# EAGLE design Un_Moto (EAGLE 6.2)
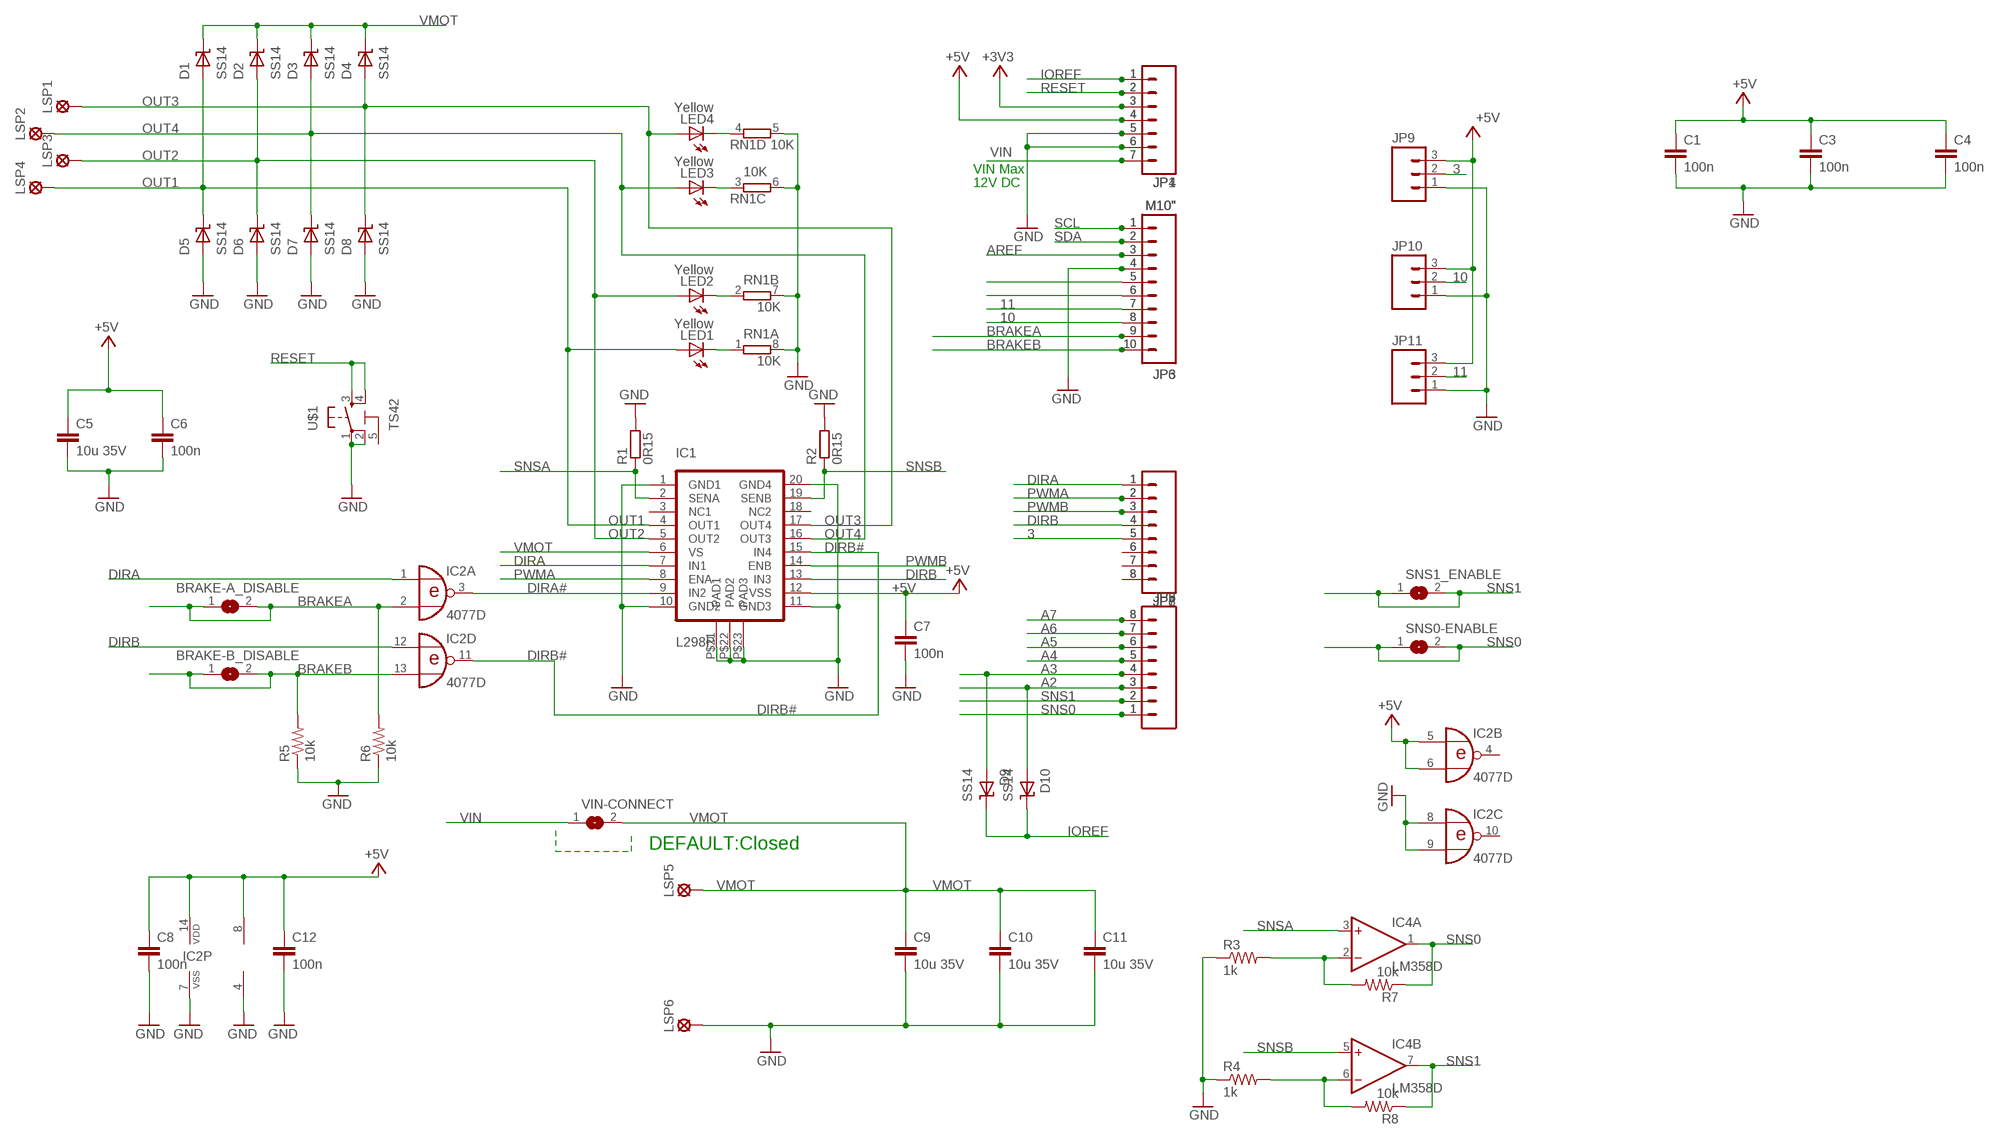
[diagram p0: schematic, sheet 1]

## Parts
BRAKE-A_DISABLE  SJ  [SJ]
BRAKE-B_DISABLE  SJ  [SJ]
C1  100n  C-EUC0603  [C0603-ROUND]
C3  100n  C-EUC0603  [C0603-ROUND]
C4  100n  C-EUC0603  [C0603-ROUND]
C5  10u 35V  C-EUC1210  [C1210]
C6  100n  C-EUC0603  [C0603-ROUND]
C7  100n  C-EUC0603  [C0603-ROUND]
C8  100n  C-EUC0603  [C0603-ROUND]
C9  10u 35V  C-EUC1210  [C1210]
C10  10u 35V  C-EUC1210  [C1210]
C11  10u 35V  C-EUC1210  [C1210]
C12  100n  C-EUC0603  [C0603-ROUND]
D1  SS14  [SMA]
D2  SS14  [SMA]
D3  SS14  [SMA]
D4  SS14  [SMA]
D5  SS14  [SMA]
D6  SS14  [SMA]
D7  SS14  [SMA]
D8  SS14  [SMA]
D9  SS14  [SMA]
D10  SS14  [SMA]
IC1  L298P  [POWER-SO20]
IC2  4077D  [SO14]
IC4  LM358D  [SO08]
JP1  M07  [1X07]
JP2  M081X08  [1X08]
JP3  M10"  [1X10]
JP4  M07  [1X07]
JP5  M081X08  [1X08]
JP6  M10"  [1X10]
JP7  M081X08  [1X08]
JP8  M081X08  [1X08]
JP9  M03PTH  [1X03]
JP10  M03PTH  [1X03]
JP11  M03PTH  [1X03]
LED1  Yellow  LEDCHIPLED_0805  [CHIPLED_0805]
LED2  Yellow  LEDCHIPLED_0805  [CHIPLED_0805]
LED3  Yellow  LEDCHIPLED_0805  [CHIPLED_0805]
LED4  Yellow  LEDCHIPLED_0805  [CHIPLED_0805]
LSP1  LSP13  [LSP13]
LSP2  LSP13  [LSP13]
LSP3  LSP13  [LSP13]
LSP4  LSP13  [LSP13]
LSP5  LSP13  [LSP13]
LSP6  LSP13  [LSP13]
R1  0R15  R-EU_R1206  [R1206]
R2  0R15  R-EU_R1206  [R1206]
R3  1k  RESISTOR0805-RES  [0805]
R4  1k  RESISTOR0805-RES  [0805]
R5  10k  RESISTOR0805-RES  [0805]
R6  10k  RESISTOR0805-RES  [0805]
R7  10k  RESISTOR0805-RES  [0805]
R8  10k  RESISTOR0805-RES  [0805]
RN1  10K  4R-NCAY16  [CAY16]
SNS0-ENABLE  SJ  [SJ]
SNS1_ENABLE  SJ  [SJ]
U$1  TS42  [TS42]
VIN-CONNECT  SJ  [SJ]

## Nets
3: JP7.5 JP8.5 JP9.2
10: JP3.8 JP6.8 JP10.2
11: JP3.7 JP6.7 JP11.2
12: JP3.6 JP6.6
13: JP3.5 JP6.5
+3V3 [power]: JP1.3 JP4.3
+5V [power]: C1.1 C3.1 C4.1 C5.1 C6.1 C7.1 C8.1 C12.1 IC1.P$12(VSS) IC2.5(B:I0) IC2.6(B:I1) IC2.14(P:VDD) IC4.8(P:V+) JP1.4 JP4.4 JP9.3 JP10.3 JP11.3
A2: D10.P$2(A) JP2.3 JP5.3
A3: D9.P$2(A) JP2.4 JP5.4
A4: JP2.5 JP5.5
A5: JP2.6 JP5.6
A6: JP2.7 JP5.7
A7: JP2.8 JP5.8
AREF: JP3.3 JP6.3
BRAKEA: BRAKE-A_DISABLE.1 BRAKE-A_DISABLE.2 IC2.2(A:I1) JP3.9 JP6.9 R6.2
BRAKEB: BRAKE-B_DISABLE.1 BRAKE-B_DISABLE.2 IC2.13(D:I1) JP3.10 JP6.10 R5.2
DIRA: IC1.P$7(IN1) IC2.1(A:I0) JP7.1 JP8.1
DIRA#: IC1.P$9(IN2) IC2.3(A:O)
DIRB: IC1.P$13(IN3) IC2.12(D:I0) JP7.4 JP8.4
DIRB#: IC1.P$15(IN4) IC2.11(D:O)
GND [power]: C1.2 C3.2 C4.2 C5.2 C6.2 C7.2 C8.2 C9.2 C10.2 C11.2 C12.2 D5.P$2(A) D6.P$2(A) D7.P$2(A) D8.P$2(A) IC1.P$1(GND1) IC1.P$10(GND2) IC1.P$11(GND3) IC1.P$20(GND4) IC1.P$21(PAD1) IC1.P$22(PAD2) IC1.P$23(PAD3) IC2.7(P:VSS) IC2.8(C:I0) IC2.9(C:I1) IC4.4(P:V-) JP1.5 JP1.6 JP3.4 JP4.5 JP4.6 JP6.4 JP9.1 JP10.1 JP11.1 LSP6.MP R1.2 R2.2 R3.1 R4.1 R5.1 R6.1 RN1.5 RN1.6 RN1.7 RN1.8 U$1.1 U$1.2
IOREF: D9.P$1(K) D10.P$1(K) JP1.1 JP4.1
N$1: LED4.C RN1.4
N$2: LED3.C RN1.3
N$3: LED2.C RN1.2
N$4: LED1.C RN1.1
N$5: IC4.2(A:-IN) R3.2 R7.2
N$7: IC4.6(B:-IN) R4.2 R8.2
N$11: JP7.6 JP8.6
N$12: JP7.7 JP8.7
N$13: JP7.8 JP8.8
OUT1: D1.P$2(A) D5.P$1(K) IC1.P$4(OUT1) LED1.A LSP4.MP
OUT2: D2.P$2(A) D6.P$1(K) IC1.P$5(OUT2) LED2.A LSP3.MP
OUT3: D4.P$2(A) D8.P$1(K) IC1.P$17(OUT4) LED4.A LSP1.MP
OUT4: D3.P$2(A) D7.P$1(K) IC1.P$16(OUT3) LED3.A LSP2.MP
PWMA: IC1.P$8(ENA) JP7.2 JP8.2
PWMB: IC1.P$14(ENB) JP7.3 JP8.3
RESET: JP1.2 JP4.2 U$1.3 U$1.4
SCL: JP3.1 JP6.1
SDA: JP3.2 JP6.2
SNS0: IC4.1(A:OUT) JP2.1 JP5.1 R7.1 SNS0-ENABLE.1 SNS0-ENABLE.2
SNS1: IC4.7(B:OUT) JP2.2 JP5.2 R8.1 SNS1_ENABLE.1 SNS1_ENABLE.2
SNSA: IC1.P$2(SENA) IC4.3(A:+IN) R1.1
SNSB: IC1.P$19(SENB) IC4.5(B:+IN) R2.1
VIN [VIN]: JP1.7 JP4.7 VIN-CONNECT.1
VMOT: C9.1 C10.1 C11.1 D1.P$1(K) D2.P$1(K) D3.P$1(K) D4.P$1(K) IC1.P$6(VS) LSP5.MP VIN-CONNECT.2
Unconnected: IC1.P$3(NC1) IC1.P$18(NC2) IC2.4(B:O) IC2.10(C:O) U$1.5

## Notes on the sheet
- VIN Max
- 12V DC
- DEFAULT:Closed

## Library data of the parts
BRAKE-A_DISABLE BRAKE-B_DISABLE SNS0-ENABLE SNS1_ENABLE VIN-CONNECT = jumper:SJ: SMD solder JUMPER
C1 C3-C12 = SmartPrj:C-EU: CAPACITOR, European symbol
D1-D10 = SmartPrj:SS14: DIODE SS14 Diode Schottky 1A 40v
IC1 = SmartPrj:L298P: L298P DUAL FUL-BRIDGE DRIVER PowerSO20
IC2 = 40xx:4077: Quad XNOR
IC4 = linear:LM358: OP AMP also LM158; LM258; LM2904 Source: http://cache.national.com/ds/LM/LM158.pdf
JP1 JP4 = 2SparkFun:M07: Header 7 Standard 7-pin 0.1" header. Use with straight break away headers (SKU : PRT-00116), right angle break away headers (PRT-00553), swiss pins (PRT-00743), machine pins (PRT-00117), and female headers (PRT-00115). NOTES ON THE VARIANTS LOCK and LOCK_LONGPADS... This footprint was designed to help hold the alignment of a through-hole component (i.e. 7-pin header) while soldering it into place. You may notice that each hole has been shifted either up or down by 0.005 of an inch from it's more standard position (which is usually a perfectly straight line). This slight alteration caused the pins (the squares in the middle) to touch the edges of the holes. Because they are alternating, it causes a "brace" to hold the header in place. 0.005 has proven to be the perfect amount of "off-center" position when using our standard breakaway headers. Although looks a little odd when you look at the bare footprint, once you have a header in there, the alteration is very hard to notice. Also, if you push a header all the way into place, it is covered up entirely on the bottom side. This idea of altering the position of holes to aid alignment will be further integrated into the Sparkfun Library for other footprints. It can help hold any component with 3 or more connection pins.
JP2 JP5 JP7 JP8 = 2SparkFun:M08: Header 8 Standard 8-pin 0.1" header. Use with straight break away headers (SKU : PRT-00116), right angle break away headers (PRT-00553), swiss pins (PRT-00743), machine pins (PRT-00117), and female headers (PRT-00115).
JP3 JP6 = 2SparkFun:M10: Header 10 Standard 10-pin 0.1" header. Use with straight break away headers (SKU : PRT-00116), right angle break away headers (PRT-00553), swiss pins (PRT-00743), machine pins (PRT-00117), and female headers (PRT-00115).
JP9-JP11 = 2SparkFun:M03: Header 3 Standard 3-pin 0.1" header. Use with straight break away headers (SKU : PRT-00116), right angle break away headers (PRT-00553), swiss pins (PRT-00743), machine pins (PRT-00117), and female headers (PRT-00115). Molex polarized connector foot print use with SKU : PRT-08232 with associated crimp pins and housings.
LED1-LED4 = led:LED: LED OSRAM: - CHIPLED LG R971, LG N971, LY N971, LG Q971, LY Q971, LO R971, LY R971 LH N974, LH R974 LS Q976, LO Q976, LY Q976 LO Q996 - Hyper CHIPLED LW Q18S LB Q993, LB Q99A, LB R99A - SideLED LS A670, LO A670, LY A670, LG A670, LP A670 LB A673, LV A673, LT A673, LW A673 LH A674 LY A675 LS A676, LA A676, LO A676, LY A676, LW A676 LS A679, LY A679, LG A679 - Hyper Micro SIDELED® LS Y876, LA Y876, LO Y876, LY Y876 LT Y87S - SmartLED LW L88C, LW L88S LB L89C, LB L89S, LG L890 LS L89K, LO L89K, LY L89K LS L896, LA L896, LO L896, LY L896 - TOPLED LS T670, LO T670, LY T670, LG T670, LP T670 LSG T670, LSP T670, LSY T670, LOP T670, LYG T670 LG T671, LOG T671, LSG T671 LB T673, LV T673, LT T673, LW T673 LH T674 LS T676, LA T676, LO T676, LY T676, LB T676, LH T676, LSB T676, LW T676 LB T67C, LV T67C, LT T67C, LS T67K, LO T67K, LY T67K, LW E67C LS E67B, LA E67B, LO E67B, LY E67B, LB E67C, LV E67C, LT E67C LW T67C LS T679, LY T679, LG T679 LS T770, LO T770, LY T770, LG T770, LP T770 LB T773, LV T773, LT T773, LW T773 LH T774 LS E675, LA E675, LY E675, LS T675 LS T776, LA T776, LO T776, LY T776, LB T776 LHGB T686 LT T68C, LB T68C - Hyper Mini TOPLED® LB M676 - Mini TOPLED Santana® LG M470 LS M47K, LO M47K, LY M47K Source: http://www.osram.convergy.de LUXEON: - LUMILED® LXK2-PW12-R00, LXK2-PW12-S00, LXK2-PW14-U00, LXK2-PW14-V00 LXK2-PM12-R00, LXK2-PM12-S00, LXK2-PM14-U00 LXK2-PE12-Q00, LXK2-PE12-R00, LXK2-PE12-S00, LXK2-PE14-T00, LXK2-PE14-U00 LXK2-PB12-K00, LXK2-PB12-L00, LXK2-PB12-M00, LXK2-PB14-N00, LXK2-PB14-P00, LXK2-PB14-Q00 LXK2-PR12-L00, LXK2-PR12-M00, LXK2-PR14-Q00, LXK2-PR14-R00 LXK2-PD12-Q00, LXK2-PD12-R00, LXK2-PD12-S00 LXK2-PH12-R00, LXK2-PH12-S00 LXK2-PL12-P00, LXK2-PL12-Q00, LXK2-PL12-R00 Source: www.luxeon.com KINGBRIGHT: KA-3528ASYC Source: www.kingbright.com
LSP1-LSP6 = solpad:LSP13: SOLDER PAD drill 1.3 mm, distributor Buerklin, 12H562
R1 R2 = SmartPrj:R-EU_: RESISTOR, European symbol
R3-R8 = 2SparkFun:RESISTOR: Resistor Basic schematic elements and footprints for 0603, 1206, and PTH resistors.
RN1 = resistor-dil:4R-N: Array Chip Resistor Source: RS Component / Phycomp
U$1 = 2SparkFun:TS42

## Net classes
0 default: width 0.406 mm, drill 0.61 mm, clearance 0.152 mm
1 power: width 0.406 mm, drill 0.61 mm, clearance 0.152 mm
2 VIN: width 0.406 mm, drill 0.61 mm, clearance 0.152 mm

## Board
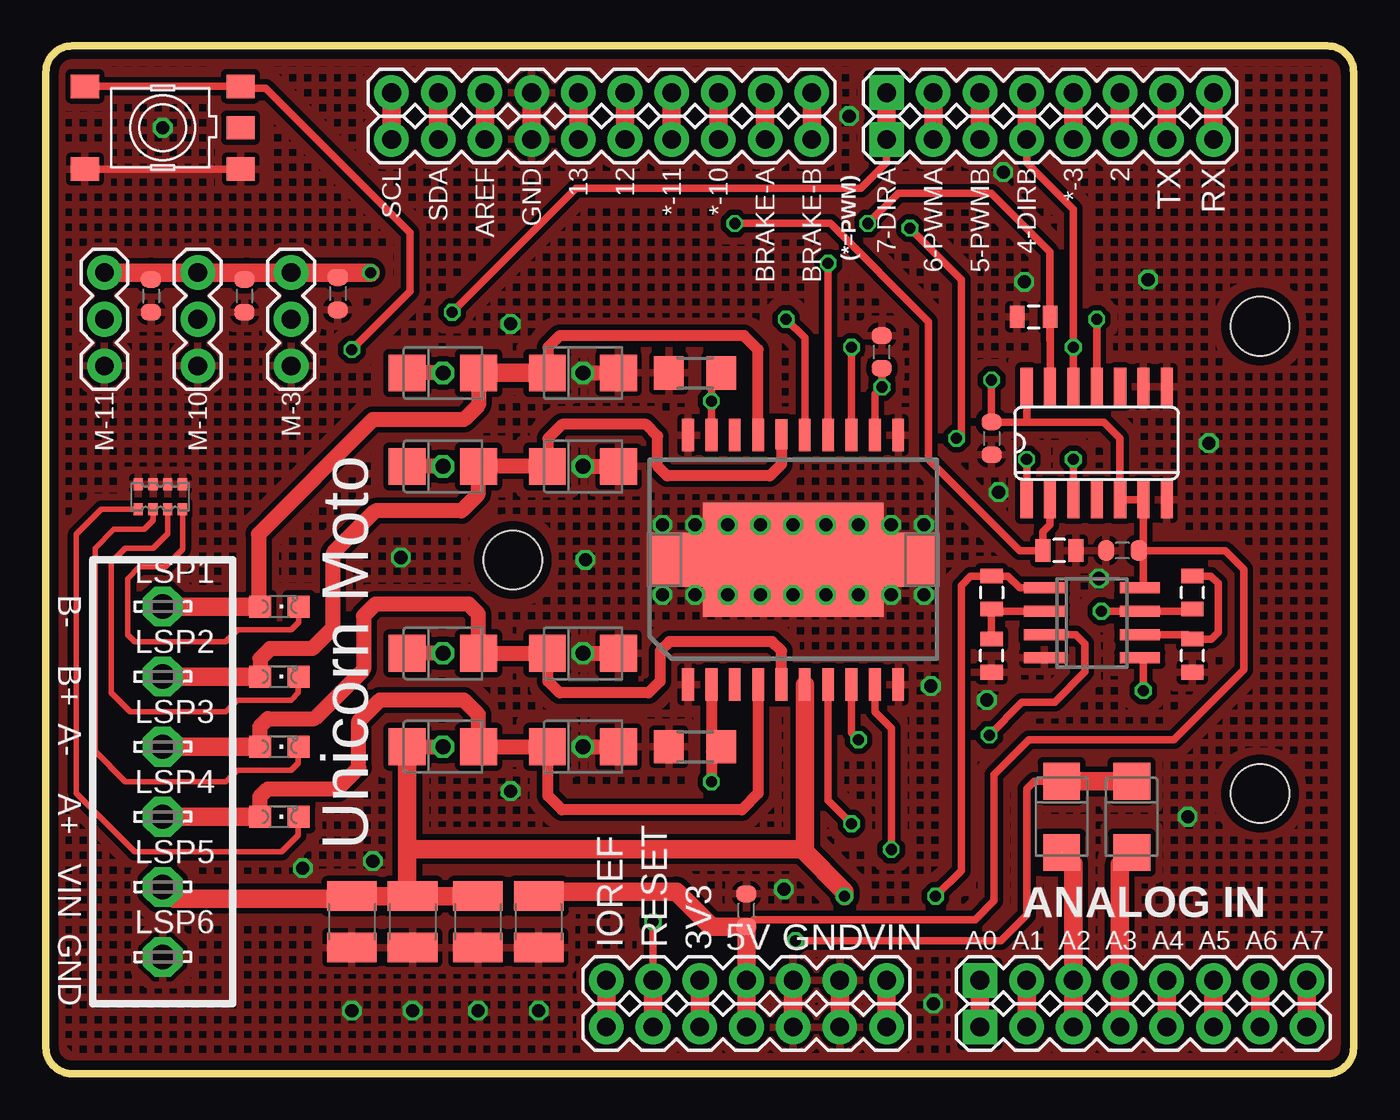
[diagram p1: board, top side]
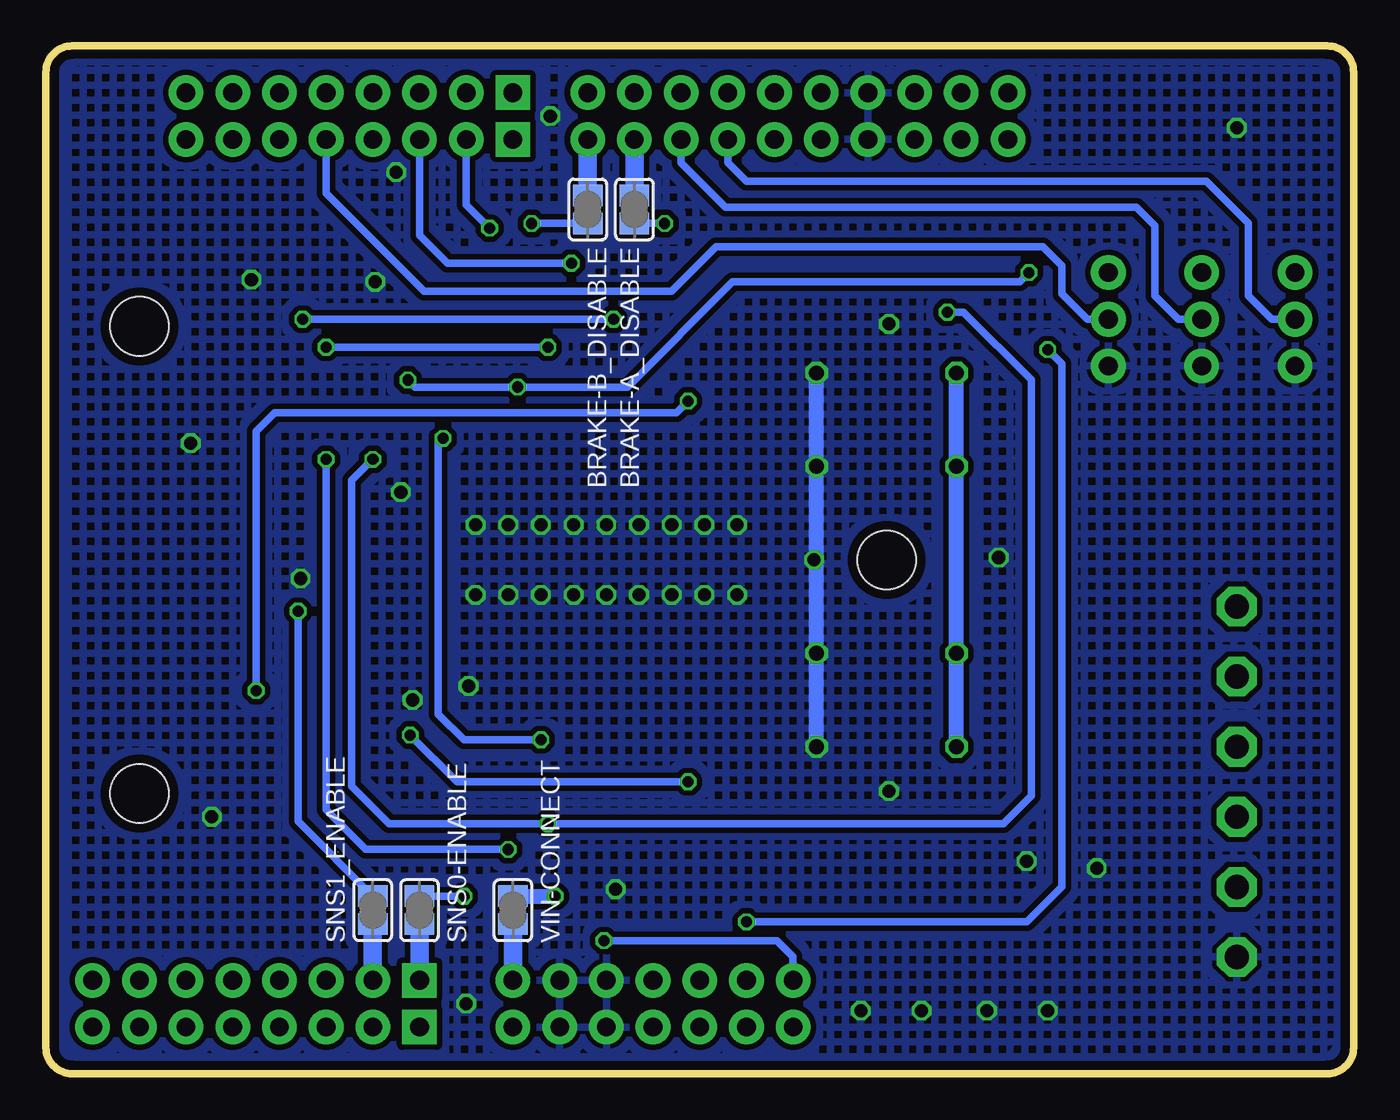
[diagram p2: board, bottom side, seen from below]

Size 71.12 x 55.88 mm. Coordinates in mm from the lower left corner, seen from the top.
Outline: 69.7,0 1.42,0 arc-90 0,1.42 0,54.46 arc-90 1.42,55.88 69.7,55.88 arc-90 71.12,54.46 71.12,1.42 arc-90 69.7,0
Copper layers (1*16): Top 0.035mm / dielectric 1.5mm / Bottom 0.035mm
Design rules: minimum track width 10mil, minimum drill 10mil, track to track 12mil, track to pad 12mil, pad to pad 12mil, via to via 12mil, smd to smd 12mil, copper to edge 20mil, drill to drill 10mil, minimum pad ring 6mil, minimum via ring 6mil, stop-mask expansion 2mil, vias tented up to drill 32mil, thermal gap 10mil
Holes 3.2 mm at 66.04,40.64 66.04,15.24 25.4,27.94

### Footprints (pad centres in the part's own frame; a part is rotated, then mirrored left to right if it is on the bottom)
SJ = smd 1.168 x 1.6: 1 -0.762,0; 2 0.762,0
C0603-ROUND = smd 0.898 x 1.1: 1 -0.889,0; 2 0.889,0
C1210 = smd 1.6 x 2.7: 1 -1.4,0; 2 1.4,0
SMA = smd 2 x 2: P$1 -1.94,0; P$2 1.94,0
POWER-SO20 = smd 0.635 x 1.778: P$1 -5.715,-6.782; P$2 -4.445,-6.782; P$3 -3.175,-6.782; P$4 -1.905,-6.782; P$5 -0.635,-6.782; P$6 0.635,-6.782; P$7 1.905,-6.782; P$8 3.175,-6.782; P$9 4.445,-6.782; P$10 5.715,-6.782; P$11 5.715,6.782; P$12 4.445,6.782; P$13 3.175,6.782; P$14 1.905,6.782; P$15 0.635,6.782; P$17 -1.905,6.782; P$18 -3.175,6.782; P$19 -4.445,6.782; P$20 -5.715,6.782 | smd 0.635 x 1.651: P$16 -0.635,6.833 | smd 9.804 x 6.198: P$21 0,0 | smd 3.048 x 2.921: P$22 -6.426,0; P$23 6.426,0
SO14 = smd 0.66 x 2.032: 1 -3.81,-3.073; 2 -2.54,-3.073; 3 -1.27,-3.073; 4 0,-3.073; 5 1.27,-3.073; 6 2.54,-3.073; 7 3.81,-3.073; 8 3.81,3.073; 9 2.54,3.073; 10 1.27,3.073; 11 0,3.073; 12 -1.27,3.073; 13 -2.54,3.073; 14 -3.81,3.073
SO08 = smd 0.6 x 2.2: 1 -1.905,-2.6; 2 -0.635,-2.6; 3 0.635,-2.6; 4 1.905,-2.6; 5 1.905,2.6; 6 0.635,2.6; 7 -0.635,2.6; 8 -1.905,2.6
1X07 = drill 1.016 pad 1.88: 1 0,0; 2 2.54,0; 3 5.08,0; 4 7.62,0; 5 10.16,0; 6 12.7,0; 7 15.24,0
1X08 = drill 1.016 pad 1.88 square: 1 0,0 | drill 1.016 pad 1.88: 2 2.54,0; 3 5.08,0; 4 7.62,0; 5 10.16,0; 6 12.7,0; 7 15.24,0; 8 17.78,0
1X10 = drill 1.016 pad 1.88: 1 0,0; 2 2.54,0; 3 5.08,0; 4 7.62,0; 5 10.16,0; 6 12.7,0; 7 15.24,0; 8 17.78,0; 9 20.32,0; 10 22.86,0
1X03 = drill 1.016 pad 1.88: 1 0,0; 2 2.54,0; 3 5.08,0
CHIPLED_0805 = smd 1.2 x 1.2: A 0,-1.05; C 0,1.05
LSP13 = drill 1.321 pad 2.159 octagon: MP 0,0
R1206 = smd 1.6 x 1.803: 1 -1.422,0; 2 1.422,0
0805 = smd 0.8 x 1.2: 1 -0.9,0; 2 0.9,0
CAY16 = smd 0.5 x 0.65: 1 -1.2,-0.675; 2 -0.4,-0.675; 3 0.4,-0.675; 4 1.2,-0.675; 5 1.2,0.675; 6 0.4,0.675; 7 -0.4,0.675; 8 -1.2,0.675
TS42 = smd 1.524 x 1.27: 1 -4.229,2.25; 2 4.229,2.25; 3 -4.229,-2.25; 4 4.229,-2.25; 5 -4.229,-0.002

### Placement (x,y rotation side)
BRAKE-A_DISABLE  39.12,46.99 270 bottom
BRAKE-B_DISABLE  41.66,46.99 270 bottom
C1  5.71,42.29 270 top
C3  15.88,42.42 270 top
C4  10.79,42.29 270 top
C5  26.8,8.25 270 top
C6  38.1,8.89 90 top
C7  45.47,39.24 90 top
C8  51.44,34.54 270 top
C9  23.5,8.25 270 top
C10  19.94,8.25 270 top
C11  16.64,8.25 270 top
C12  58.55,28.45 180 top
D1  21.59,17.78 0 top
D2  21.59,22.86 0 top
D3  21.59,33.02 0 top
D4  21.59,38.1 0 top
D5  29.21,17.78 0 top
D6  29.21,22.86 0 top
D7  29.21,33.02 0 top
D8  29.21,38.1 0 top
D9  59.05,13.97 270 top
D10  55.24,13.97 270 top
IC1  40.64,27.94 0 top
IC2  57.15,34.29 0 top
IC4  56.9,24.51 270 top
JP1  30.48,5.08 0 top
JP2  50.8,2.54 0 top
JP3  18.8,50.8 0 top
JP4  30.48,2.54 0 top
JP5  50.8,5.08 0 top
JP6  18.8,53.34 0 top
JP7  45.72,50.8 0 top
JP8  45.72,53.34 0 top
JP9  13.34,38.48 90 top
JP10  8.26,38.48 90 top
JP11  3.17,38.48 90 top
LED1  12.7,13.97 270 top
LED2  12.7,17.78 270 top
LED3  12.7,21.59 270 top
LED4  12.7,25.4 270 top
LSP1  6.35,25.4 0 top
LSP2  6.35,21.59 0 top
LSP3  6.35,17.78 0 top
LSP4  6.35,13.97 0 top
LSP5  6.35,10.16 0 top
LSP6  6.35,6.35 0 top
R1  35.31,17.78 180 top
R2  35.31,38.1 180 top
R3  51.44,22.73 90 top
R4  62.36,22.73 90 top
R5  53.72,41.15 0 top
R6  55.12,28.45 180 top
R7  51.44,26.16 270 top
R8  62.36,26.16 90 top
RN1  6.22,31.37 0 top
SNS0-ENABLE  50.8,8.89 90 bottom
SNS1_ENABLE  53.34,8.89 90 bottom
U$1  6.35,51.44 180 top
VIN-CONNECT  45.72,8.89 90 bottom

### Tracks (layer width: path | path; a pad name or v marks a point on that pad's centre or on a via)
3
  Top 1.016: JP8.5 JP7.5
  Bottom 0.406: JP9.2 14.48,41.02 15.88,42.42 15.88,43.94 16.89,44.96 34.67,44.96 37.08,42.55 50.55,42.55 55.88,47.88 JP7.5
10
  Top 1.016: JP6.8 JP3.8
  Bottom 0.406: JP10.2 9.53,41.02 10.79,42.29 10.79,46.1 11.81,47.12 34.16,47.12 36.58,49.53 JP3.8
11
  Top 1.016: JP6.7 JP3.7
  Bottom 0.406: JP11.2 4.45,41.02 5.71,42.29 5.71,46.23 8,48.51 33.02,48.51 34.04,49.53 JP3.7
12
  Top 1.016: JP6.6 JP3.6
13
  Top 1.016: JP6.5 JP3.5
+3V3
  Top 1.016: JP1.3 JP4.3
+5V  (via drill 0.6)
  Top 0.406: 53.47,35.43 57.53,35.43 58.42,34.54 IC2.5 IC2.6 59.69,28.45 | 53.47,35.43 C8.1 v51.44,37.72 | IC2.14 53.34,35.56 53.47,35.43 | 59.69,28.45 59.69,26.61 IC4.8 | 59.69,28.45 59.56,28.57 C12.1 64.14,28.45 65.15,27.43 65.15,21.97 61.34,18.16 53.47,18.16 51.56,16.26 51.56,9.4 50.55,8.38 38.48,8.38 C6.1 | C1.1 5.71,43.56 | C4.1 10.79,43.43 10.92,43.56 | IC1.P$12 45.09,36.96 v45.47,37.34 C7.1
  Top 1.016: JP4.4 JP1.4 C6.1 36.2,8 34.29,9.91 26.8,9.91 C5.1 | JP11.3 5.71,43.56 JP10.3 10.92,43.56 JP9.3 | C3.1 15.62,43.56 JP9.3 | v17.65,43.56 JP9.3
  Bottom 0.406: v17.65,43.56 18.16,43.05 33.78,43.05 39.5,37.34 v45.47,37.34 51.05,37.34 v51.44,37.72
A2  (1 unrouted)
  Top 1.016: JP2.3 JP5.3 55.88,11.43 55.24,12.07
A3
  Top 1.016: JP2.4 JP5.4 58.42,11.39 D9.P$2
A4
  Top 1.016: JP2.5 JP5.5
A5
  Top 1.016: JP2.6 JP5.6
A6
  Top 1.016: JP2.7 JP5.7
A7
  Top 1.016: JP2.8 JP5.8
AREF
  Top 1.016: JP6.3 JP3.3
BRAKEA  (via drill 0.6)
  Top 0.406: IC2.2 54.61,29.84 54.23,29.46 R6.2 52.96,28.45 48.01,33.4 48.01,40.89 42.67,46.23 v37.47,46.23
  Top 1.016: JP6.9 JP3.9
  Bottom 0.406: BRAKE-A_DISABLE.1 BRAKE-A_DISABLE.2 v37.47,46.23
  Bottom 1.016: BRAKE-A_DISABLE.1 JP3.9
BRAKEB  (via drill 0.6)
  Top 0.305: 54.62,38.11 54.61,38.1
  Top 0.406: 54.61,38.1 IC2.13 54.62,37.37 R5.2 54.61,39.89 54.61,44.7 51.44,47.88 46.35,47.88 v44.7,46.23
  Top 1.016: JP6.10 JP3.10
  Bottom 0.406: 41.66,48.01 BRAKE-B_DISABLE.1 BRAKE-B_DISABLE.2 v44.7,46.23
  Bottom 1.016: 41.66,48.01 JP3.10
DIRA  (via drill 0.6)
  Top 0.406: IC2.1 v53.34,33.4 | IC1.P$7 42.55,14.86 v43.81,13.59 | JP7.1 45.72,49.53 44.32,48.13 28.83,48.13 v22.1,41.4
  Top 1.016: JP8.1 JP7.1
  Bottom 0.406: v53.34,33.4 54.48,32.26 54.48,15.62 52.45,13.59 v43.81,13.59 19.05,13.59 17.53,15.11 17.53,37.72 21.21,41.4 v22.1,41.4
DIRA#  (via drill 0.6)
  Top 0.406: IC2.3 v55.88,33.4 | IC1.P$9 45.09,19.68 45.97,18.8 v45.97,12.19
  Bottom 0.406: v55.88,33.4 55.88,14.35 53.72,12.19 v45.97,12.19
DIRB  (via drill 0.6)
  Top 0.406: IC2.12 v55.88,39.5 55.88,46.99 53.34,49.53 JP7.4 | v43.81,39.5 IC1.P$13
  Top 1.016: JP8.4 JP7.4
  Bottom 0.406: v43.81,39.5 v55.88,39.5
DIRB#  (via drill 0.6)
  Top 0.406: IC2.11 v57.15,41.02 | IC1.P$15 41.27,40.01 v40.26,41.02
  Bottom 0.406: v40.26,41.02 v57.15,41.02
GND  (via drill 0.71, 0.81)
  Top 0.406: U$1.1 U$1.2
  Top 0.813: v29.21,38.1 D8.P$2 | v29.21,17.78 D5.P$2 | v29.21,22.86 D6.P$2 | v29.21,33.02 D7.P$2
  Top 1.016: JP4.5 JP1.5 | JP4.6 JP1.6 | JP6.4 JP3.4
  Bottom 0.813: v29.21,38.1 v29.21,33.02 v29.21,22.86 v29.21,17.78
  other vias: 45.97,29.84 35.31,29.84 35.31,26.04 25.27,40.77 29.34,27.94 6.35,51.44 33.53,29.84 33.53,26.04 47.75,29.84 53.21,43.05 47.75,26.04 45.97,26.04 48.26,3.81 43.69,52.07 16.64,3.43 19.94,3.43 23.5,3.43 26.8,3.43 62.1,13.97 57.28,26.92 51.82,31.62 63.25,34.29 59.94,43.18 40.13,10.03 48.13,21.08 51.18,20.32 19.3,28.07 40.64,29.84 40.64,26.04 37.08,29.84 38.86,29.84 42.42,29.84 44.2,29.84 37.08,26.04 38.86,26.04 42.42,26.04 44.2,26.04 25.27,15.37 17.78,11.56 13.97,11.18 52.07,49.02
  pour Bottom (hatched): 0,55.88 71.12,55.88 71.12,0 0,0
  pour Top (hatched): 0,55.88 71.12,55.88 71.12,0 0,0
IOREF  (via drill 0.6)
  Top 0.406: D10.P$1 53.76,15.91 53.34,15.49 53.34,8.64 51.94,7.24 v40.77,7.24
  Top 1.016: JP1.1 JP4.1 | D10.P$1 D9.P$1
  Bottom 0.406: v40.77,7.24 31.37,7.24 30.48,6.35 JP1.1
N$1
  Top 0.305: LED4.C 13.75,24.54 13.34,24.13 10.41,24.13 9.78,23.49 4.83,23.49 4.45,23.88 4.45,26.92 5.08,27.56 6.48,27.56 7.42,28.5 RN1.4
N$2
  Top 0.305: LED3.C 13.72,21.56 13.72,20.7 13.34,20.32 10.41,20.32 9.78,19.68 4.57,19.68 3.56,20.7 3.56,27.81 4.32,28.57 5.84,28.57 6.62,29.36 RN1.3
N$3
  Top 0.305: LED2.C 13.72,17.75 13.72,16.89 13.34,16.51 10.41,16.51 9.78,15.88 4.32,15.88 2.67,17.53 2.67,28.57 3.68,29.59 5.33,29.59 5.82,30.08 RN1.2
N$4
  Top 0.305: LED1.C 13.72,13.94 13.72,12.95 12.83,12.07 4.83,12.07 1.65,15.24 1.65,29.34 3.01,30.69 RN1.1
N$5
  Top 0.406: IC4.2 51.55,25.15 R7.2 R3.2
N$7
  Top 0.406: IC4.6 62.11,23.88 R4.2 63.38,23.63 63.75,24 63.75,26.67 63.36,27.06 R8.2
N$11
  Top 1.016: JP8.6 JP7.6
N$12
  Top 1.016: JP8.7 JP7.7
N$13
  Top 1.016: JP8.8 JP7.8
OUT1
  Top 0.406: 27.3,17.65 27.27,17.69 D5.P$1
  Top 0.61: IC1.P$4 38.73,15.24 37.85,14.35 28.07,14.35 27.3,15.11 27.3,17.65
  Top 0.813: D5.P$1 D1.P$2 23.53,19.52 22.73,20.32 18.16,20.32 17.02,19.18 17.02,16.64 15.88,15.49 12.06,15.49 11.65,15.08 LED1.A
  Top 1.016: LED1.A LSP4.MP
OUT2
  Top 0.61: IC1.P$5 40.01,22.99 39.5,23.49 33.91,23.49 33.4,22.99 33.4,21.34 32.77,20.7 27.94,20.7 27.3,21.34 27.3,22.82 D6.P$1
  Top 0.813: D6.P$1 D2.P$2 23.53,24.98 22.99,25.53 17.91,25.53 17.27,24.89 17.27,21.97 14.61,19.3 12.06,19.3 11.65,18.89 LED2.A
  Top 1.016: LED2.A LSP3.MP
OUT3
  Top 0.406: D8.P$1 27.3,38.13 27.3,38.23 | LED4.A 11.56,25.49 11.56,25.53
  Top 0.61: IC1.P$17 38.73,39.37 37.97,40.13 27.94,40.13 27.3,39.5 27.3,38.23
  Top 0.813: D4.P$2 23.53,36.36 22.73,35.56 17.78,35.56 11.56,29.34 11.56,25.53
  Top 1.016: D4.P$2 D8.P$1 | LSP1.MP LED4.A
OUT4
  Top 0.61: IC1.P$16 40.01,33.15 39.37,32.51 33.78,32.51 33.27,33.02 33.27,34.67 32.64,35.31 28.07,35.31 27.3,34.54 27.3,33.05 D7.P$1
  Top 0.813: D7.P$1 D3.P$2 23.5,32.98 23.5,31.5 22.61,30.61 17.91,30.61 15.62,28.32 15.62,24.26 14.48,23.11 12.19,23.11 11.65,22.57 LED3.A
  Top 1.016: LED3.A LSP2.MP
PWMA  (via drill 0.6)
  Top 0.406: IC1.P$8 43.81,18.54 v44.2,18.16 | v49.53,34.54 49.78,34.8 49.78,43.18 v46.99,45.97
  Top 1.016: JP8.2 JP7.2
  Bottom 0.406: v44.2,18.16 48.39,18.16 49.78,19.56 49.78,34.29 v49.53,34.54 | v46.99,45.97 48.26,47.24 JP7.2
PWMB  (via drill 0.6)
  Top 0.406: IC1.P$14 v42.55,44.07
  Top 1.016: JP8.3 JP7.3
  Bottom 0.406: JP7.3 50.8,45.59 49.28,44.07 v42.55,44.07
RESET  (via drill 0.6)
  Top 0.406: JP1.2 v33.02,8.25 | v16.64,39.37 19.81,42.55 19.81,45.72 11.94,53.59 10.67,53.59 U$1.3 U$1.4
  Top 1.016: JP4.2 JP1.2
  Bottom 0.406: v33.02,8.25 17.78,8.25 15.88,10.16 15.88,38.61 v16.64,39.37
SCL
  Top 1.016: JP6.1 JP3.1
SDA
  Top 1.016: JP6.2 JP3.2
SNS0  (via drill 0.6)
  Top 0.406: IC4.1 52.96,26.42 52.32,27.05 R7.1 51.32,27.05 50.29,27.05 49.78,26.54 49.78,11.05 v48.39,9.65
  Top 1.016: JP2.1 JP5.1
  Bottom 0.406: SNS0-ENABLE.1 SNS0-ENABLE.2 v48.39,9.65
  Bottom 1.016: SNS0-ENABLE.1 JP5.1
SNS1  (via drill 0.6)
  Top 0.406: v57.4,25.15 IC4.7 62.23,25.15 62.36,25.27 R8.1
  Top 1.016: JP2.2 JP5.2
  Bottom 0.406: SNS1_ENABLE.1 SNS1_ENABLE.2 57.4,13.72 v57.4,25.15
  Bottom 1.016: SNS1_ENABLE.1 JP5.2
SNSA  (via drill 0.6)
  Top 0.406: IC4.3 56.01,23.88 56.52,23.37 56.52,21.84 54.86,20.19 53.09,20.19 v51.31,18.41 | R1.1 36.7,17.75 36.7,17.53 | 36.7,17.53 36.83,17.53 | 36.7,17.53 36.2,17.53
  Top 0.61: IC1.P$2 36.2,17.53 v36.2,15.88
  Bottom 0.406: v36.2,15.88 48.77,15.88 v51.31,18.41
SNSB  (via drill 0.6)
  Top 0.406: IC4.5 59.69,22.61 v59.69,20.83 | R2.1 36.2,37.57 v36.2,36.58 IC1.P$19
  Bottom 0.406: v59.69,20.83 59.69,34.92 58.67,35.94 36.83,35.94 v36.2,36.58
VIN
  Top 1.016: JP4.7 JP1.7
  Bottom 1.016: VIN-CONNECT.1 JP1.7
VMOT  (via drill 0.6, 0.81)
  Top 0.813: v21.59,38.1 D4.P$1 | D1.P$1 v21.59,17.78 | v21.59,22.86 D2.P$1 | v21.59,33.02 D3.P$1
  Top 1.016: C10.1 C11.1 16.51,9.53 6.99,9.53 LSP5.MP | C10.1 20.19,9.66 20.32,9.53 | C10.1 C9.1 | D1.P$1 19.65,12.19 | 19.65,12.19 19.65,9.94 C10.1 | IC1.P$6 41.27,12.19 41.15,12.19 | 41.15,12.19 19.65,12.19 | v43.43,9.65 43.43,9.91 41.15,12.19
  Bottom 0.61: VIN-CONNECT.2 45.72,8.13
  Bottom 0.813: v21.59,17.78 v21.59,22.86 v21.59,33.02 v21.59,38.1 | VIN-CONNECT.2 v43.43,9.65

### Text on the board
tPlace: B- | B+ | A- | A+ | VIN | GND
tNames: SCL | SDA | AREF | GND | 13 | 12 | *-11 | *-10 | BRAKE-A | BRAKE-B | 7-DIRA | 6-PWMA | 5-PWMB | 4-DIRB | *-3 | 2 | TX | RX | (*=PWM) | M-11 | M-10 | M-3 | Unicorn Moto | ANALOG IN | IOREF | RESET | 3V3 | 5V | GND | VIN | A0 | A1 | A2 | A3 | A4 | A5 | A6 | A7